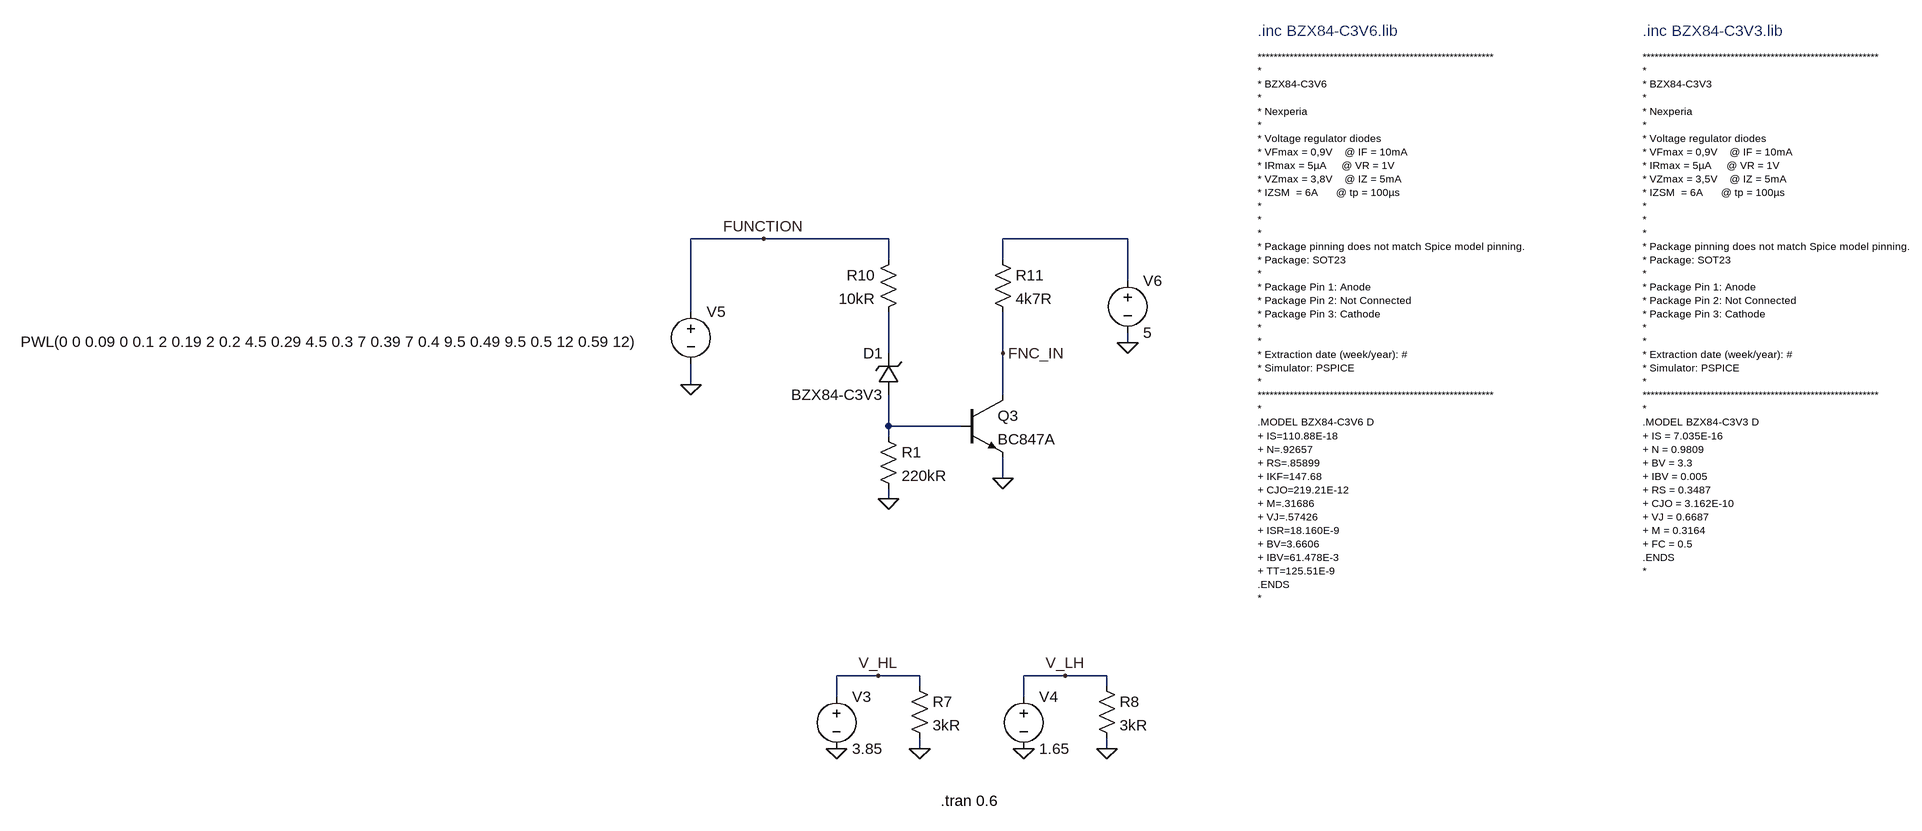
[diagram p0: schematic FUNCTION_input_circuit.asc]
FUNCTION_input_circuit.asc, the LTspice schematic file:
Version 4
SHEET 1 2012 680
WIRE -208 -720 -320 -720
WIRE -16 -720 -208 -720
WIRE 352 -720 160 -720
WIRE -16 -688 -16 -720
WIRE 160 -688 160 -720
WIRE 352 -656 352 -720
WIRE -320 -608 -320 -720
WIRE 352 -560 352 -576
WIRE -16 -544 -16 -608
WIRE 160 -544 160 -608
WIRE -320 -496 -320 -528
WIRE 160 -480 160 -544
WIRE -16 -432 -16 -480
WIRE 96 -432 -16 -432
WIRE -16 -416 -16 -432
WIRE 160 -352 160 -384
WIRE -16 -320 -16 -336
WIRE -32 -48 -96 -48
WIRE 32 -48 -32 -48
WIRE 256 -48 192 -48
WIRE 320 -48 256 -48
WIRE 32 -32 32 -48
WIRE 320 -32 320 -48
WIRE -96 -16 -96 -48
WIRE 192 -16 192 -48
WIRE 32 64 32 48
WIRE 320 64 320 48
FLAG -96 64 0
FLAG 192 64 0
FLAG 32 64 0
FLAG 320 64 0
FLAG -32 -48 V_HL
FLAG 256 -48 V_LH
FLAG 160 -352 0
FLAG -320 -496 0
FLAG 352 -560 0
FLAG 160 -544 FNC_IN
FLAG -208 -720 FUNCTION
FLAG -16 -320 0
SYMBOL voltage -96 -32 R0
WINDOW 123 0 0 Left 0
WINDOW 39 0 0 Left 0
SYMATTR InstName V3
SYMATTR Value 3.85
SYMBOL voltage 192 -32 R0
WINDOW 123 0 0 Left 0
WINDOW 39 0 0 Left 0
SYMATTR InstName V4
SYMATTR Value 1.65
SYMBOL res 16 -48 R0
SYMATTR InstName R7
SYMATTR Value 3kR
SYMBOL res 304 -48 R0
SYMATTR InstName R8
SYMATTR Value 3kR
SYMBOL npn 96 -480 R0
SYMATTR InstName Q3
SYMATTR Value BC847A
SYMBOL res 0 -704 M0
SYMATTR InstName R10
SYMATTR Value 10kR
SYMBOL voltage -320 -624 R0
WINDOW 123 0 0 Left 0
WINDOW 39 0 0 Left 0
WINDOW 3 -1031 62 Left 2
SYMATTR Value PWL(0 0 0.09 0 0.1 2 0.19 2 0.2 4.5 0.29 4.5 0.3 7 0.39 7 0.4 9.5 0.49 9.5 0.5 12 0.59 12)
SYMATTR InstName V5
SYMBOL res 144 -704 R0
SYMATTR InstName R11
SYMATTR Value 4k7R
SYMBOL voltage 352 -672 R0
WINDOW 123 0 0 Left 0
WINDOW 39 0 0 Left 0
SYMATTR InstName V6
SYMATTR Value 5
SYMBOL zener 0 -480 R180
WINDOW 0 24 64 Left 2
WINDOW 3 24 0 Left 2
SYMATTR InstName D1
SYMATTR Value BZX84-C3V3
SYMBOL res -32 -432 R0
SYMATTR InstName R1
SYMATTR Value 220kR
TEXT 64 144 Left 2 !.tran 0.6
TEXT 552 -1040 Left 2 ;.inc BZX84-C3V6.lib
TEXT 552 -1000 Left 1 !***********************************************************\n*\n* BZX84-C3V6\n*\n* Nexperia\n*\n* Voltage regulator diodes\n* VFmax = 0,9V    @ IF = 10mA\n* IRmax = 5µA     @ VR = 1V\n* VZmax = 3,8V    @ IZ = 5mA\n* IZSM  = 6A      @ tp = 100µs\n*\n*\n*\n* Package pinning does not match Spice model pinning.\n* Package: SOT23\n*\n* Package Pin 1: Anode\n* Package Pin 2: Not Connected\n* Package Pin 3: Cathode\n*\n*\n* Extraction date (week/year): #\n* Simulator: PSPICE\n*\n***********************************************************\n*\n.MODEL BZX84-C3V6 D\n+ IS=110.88E-18\n+ N=.92657\n+ RS=.85899\n+ IKF=147.68\n+ CJO=219.21E-12\n+ M=.31686\n+ VJ=.57426\n+ ISR=18.160E-9\n+ BV=3.6606\n+ IBV=61.478E-3\n+ TT=125.51E-9\n.ENDS\n*
TEXT 1144 -1000 Left 1 !***********************************************************\n*\n* BZX84-C3V3\n*\n* Nexperia\n*\n* Voltage regulator diodes\n* VFmax = 0,9V    @ IF = 10mA\n* IRmax = 5µA     @ VR = 1V\n* VZmax = 3,5V    @ IZ = 5mA\n* IZSM  = 6A      @ tp = 100µs\n*\n*\n*\n* Package pinning does not match Spice model pinning.\n* Package: SOT23\n*\n* Package Pin 1: Anode\n* Package Pin 2: Not Connected\n* Package Pin 3: Cathode\n*\n*\n* Extraction date (week/year): #\n* Simulator: PSPICE\n*\n***********************************************************\n*\n.MODEL BZX84-C3V3 D\n+ IS = 7.035E-16\n+ N = 0.9809\n+ BV = 3.3\n+ IBV = 0.005\n+ RS = 0.3487\n+ CJO = 3.162E-10\n+ VJ = 0.6687\n+ M = 0.3164\n+ FC = 0.5\n.ENDS\n*
TEXT 1144 -1040 Left 2 ;.inc BZX84-C3V3.lib

The netlist it stands for:
* FUNCTION_input_circuit.asc
V3 V_HL 0 3.85
V4 V_LH 0 1.65
R7 V_HL 0 3kR
R8 V_LH 0 3kR
Q3 FNC_IN N003 0 0 BC847A
R10 FUNCTION N002 10kR
V5 FUNCTION 0 PWL(0 0 0.09 0 0.1 2 0.19 2 0.2 4.5 0.29 4.5 0.3 7 0.39 7 0.4 9.5 0.49 9.5 0.5 12 0.59 12)
R11 N001 FNC_IN 4k7R
V6 N001 0 5
D1 N003 N002 BZX84-C3V3
R1 N003 0 220kR
.model D D
.lib standard.dio
.model NPN NPN
.model PNP PNP
.lib standard.bjt
.tran 0.6
* .inc BZX84-C3V6.lib
***********************************************************
*
* BZX84-C3V6
*
* Nexperia
*
* Voltage regulator diodes
* VFmax = 0,9V    @ IF = 10mA
* IRmax = 5µA     @ VR = 1V
* VZmax = 3,8V    @ IZ = 5mA
* IZSM  = 6A      @ tp = 100µs
*
*
*
* Package pinning does not match Spice model pinning.
* Package: SOT23
*
* Package Pin 1: Anode
* Package Pin 2: Not Connected
* Package Pin 3: Cathode
*
*
* Extraction date (week/year): #
* Simulator: PSPICE
*
***********************************************************
*
.MODEL BZX84-C3V6 D
+ IS=110.88E-18
+ N=.92657
+ RS=.85899
+ IKF=147.68
+ CJO=219.21E-12
+ M=.31686
+ VJ=.57426
+ ISR=18.160E-9
+ BV=3.6606
+ IBV=61.478E-3
+ TT=125.51E-9
.ENDS
*
***********************************************************
*
* BZX84-C3V3
*
* Nexperia
*
* Voltage regulator diodes
* VFmax = 0,9V    @ IF = 10mA
* IRmax = 5µA     @ VR = 1V
* VZmax = 3,5V    @ IZ = 5mA
* IZSM  = 6A      @ tp = 100µs
*
*
*
* Package pinning does not match Spice model pinning.
* Package: SOT23
*
* Package Pin 1: Anode
* Package Pin 2: Not Connected
* Package Pin 3: Cathode
*
*
* Extraction date (week/year): #
* Simulator: PSPICE
*
***********************************************************
*
.MODEL BZX84-C3V3 D
+ IS = 7.035E-16
+ N = 0.9809
+ BV = 3.3
+ IBV = 0.005
+ RS = 0.3487
+ CJO = 3.162E-10
+ VJ = 0.6687
+ M = 0.3164
+ FC = 0.5
.ENDS
*
* .inc BZX84-C3V3.lib
.backanno
.end